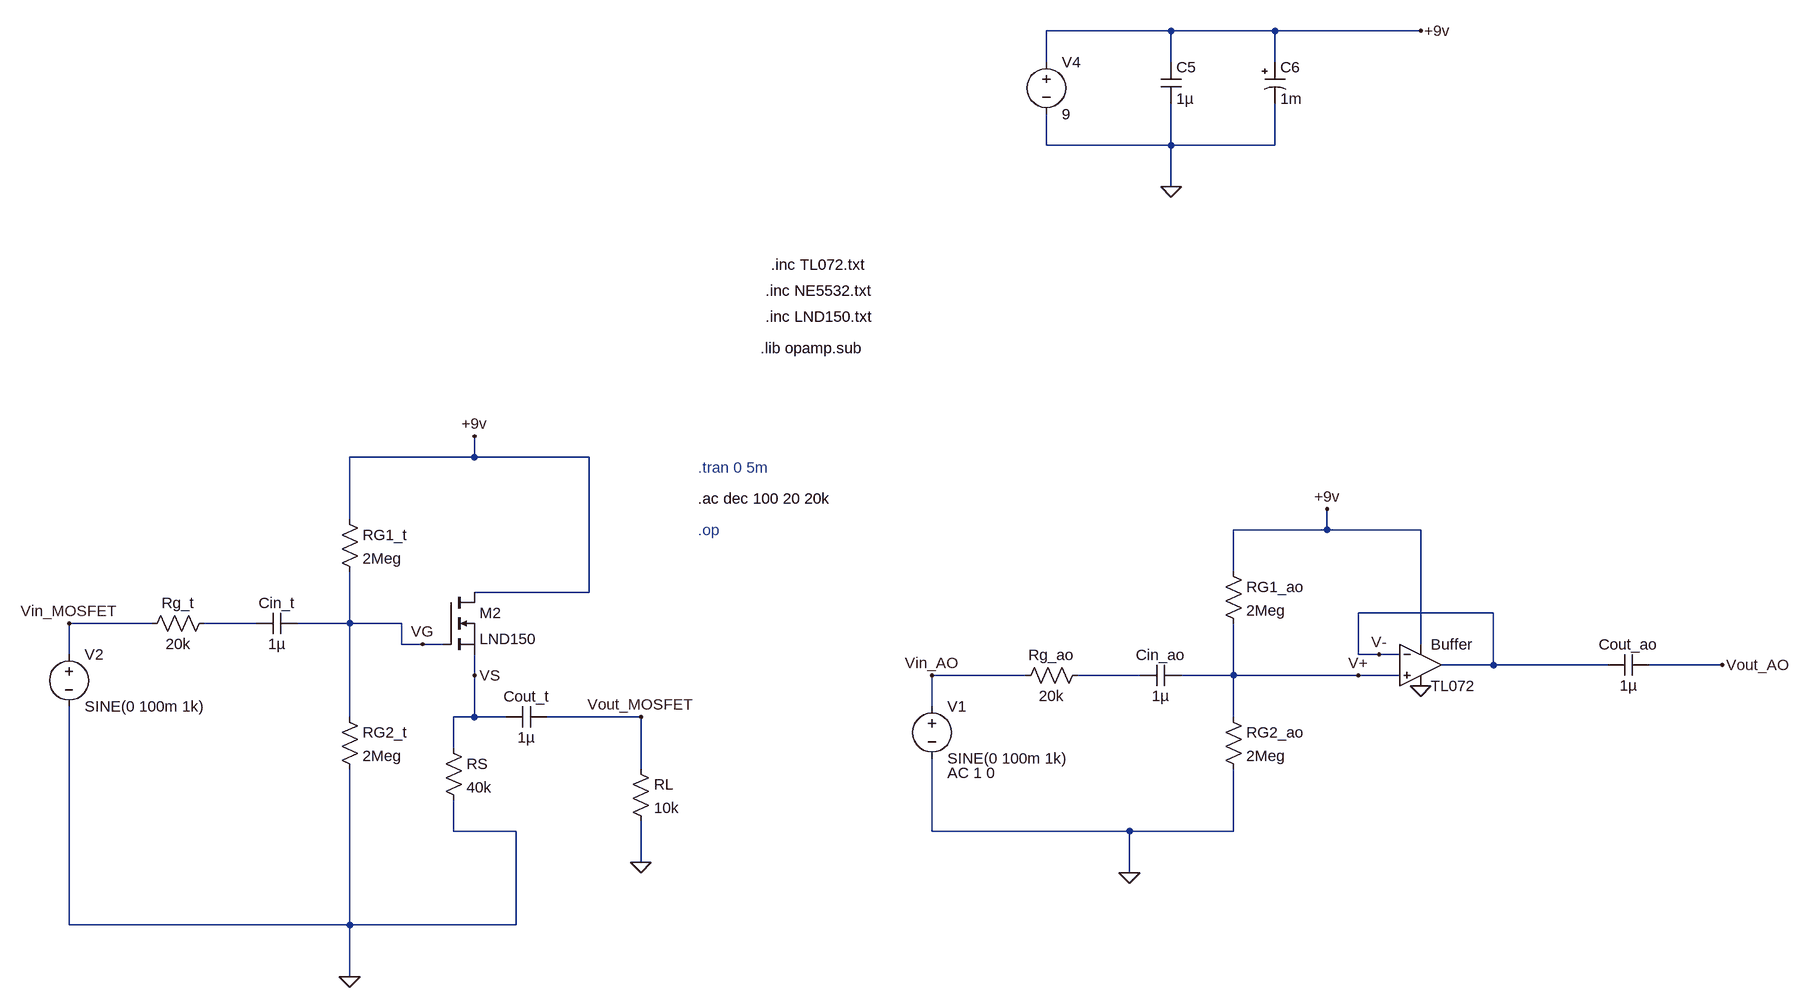
[diagram p0: schematic input_buffer.asc]
input_buffer.asc, the LTspice schematic file:
Version 4
SHEET 1 4380 1924
WIRE 2720 -288 2528 -288
WIRE 2880 -288 2720 -288
WIRE 3104 -288 2880 -288
WIRE 2528 -240 2528 -288
WIRE 2720 -240 2720 -288
WIRE 2880 -240 2880 -288
WIRE 2528 -112 2528 -160
WIRE 2720 -112 2720 -176
WIRE 2720 -112 2528 -112
WIRE 2880 -112 2880 -176
WIRE 2880 -112 2720 -112
WIRE 2720 -48 2720 -112
WIRE 1648 368 1648 336
WIRE 1648 368 1456 368
WIRE 1824 368 1648 368
WIRE 1456 464 1456 368
WIRE 2960 480 2960 448
WIRE 2960 480 2816 480
WIRE 3104 480 2960 480
WIRE 2816 544 2816 480
WIRE 1824 576 1824 368
WIRE 1824 576 1648 576
WIRE 3216 608 3008 608
WIRE 1152 624 1024 624
WIRE 1312 624 1232 624
WIRE 1456 624 1456 544
WIRE 1456 624 1376 624
WIRE 1536 624 1456 624
WIRE 1536 656 1536 624
WIRE 1568 656 1536 656
WIRE 1600 656 1568 656
WIRE 3104 656 3104 480
WIRE 1024 672 1024 624
WIRE 3008 672 3008 608
WIRE 3040 672 3008 672
WIRE 3072 672 3040 672
WIRE 3216 688 3216 608
WIRE 3216 688 3136 688
WIRE 3392 688 3216 688
WIRE 3568 688 3456 688
WIRE 1648 704 1648 672
WIRE 2496 704 2352 704
WIRE 2672 704 2576 704
WIRE 2816 704 2816 624
WIRE 2816 704 2736 704
WIRE 3008 704 2816 704
WIRE 3072 704 3008 704
WIRE 2352 752 2352 704
WIRE 1456 768 1456 624
WIRE 1648 768 1648 704
WIRE 1648 768 1616 768
WIRE 1696 768 1648 768
WIRE 1904 768 1760 768
WIRE 2816 768 2816 704
WIRE 1616 816 1616 768
WIRE 1904 848 1904 768
WIRE 1616 944 1616 896
WIRE 1712 944 1616 944
WIRE 2352 944 2352 832
WIRE 2656 944 2352 944
WIRE 2816 944 2816 848
WIRE 2816 944 2656 944
WIRE 1904 992 1904 928
WIRE 2656 1008 2656 944
WIRE 1024 1088 1024 752
WIRE 1456 1088 1456 848
WIRE 1456 1088 1024 1088
WIRE 1712 1088 1712 944
WIRE 1712 1088 1456 1088
WIRE 1456 1168 1456 1088
FLAG 2720 -48 0
FLAG 3104 -288 +9v
FLAG 2352 704 Vin_AO
FLAG 3568 688 Vout_AO
FLAG 3104 720 0
FLAG 2656 1008 0
FLAG 2960 448 +9v
FLAG 1456 1168 0
FLAG 1024 624 Vin_MOSFET
FLAG 1904 768 Vout_MOSFET
FLAG 1568 656 VG
FLAG 1648 704 VS
FLAG 1648 336 +9v
FLAG 3008 704 V+
FLAG 3040 672 V-
FLAG 1904 992 0
SYMBOL voltage 2528 -256 R0
SYMATTR InstName V4
SYMATTR Value 9
SYMBOL Cap 2704 -240 R0
SYMATTR InstName C5
SYMATTR Value 1µ
SYMBOL polcap 2864 -240 R0
WINDOW 3 24 56 Left 2
SYMATTR Value 1m
SYMATTR InstName C6
SYMATTR Description Capacitor
SYMATTR Type cap
SYMATTR SpiceLine Rser=21m Lser=0 mfg="Chemi-Con" pn="LXF25VB222M12X40LL" type="Al electrolytic"
SYMBOL voltage 2352 736 R0
WINDOW 123 24 118 Left 2
WINDOW 39 0 0 Left 0
SYMATTR Value2 AC 1 0
SYMATTR InstName V1
SYMATTR Value SINE(0 100m 1k)
SYMBOL Cap 2736 688 R90
WINDOW 0 0 32 VBottom 2
WINDOW 3 32 32 VTop 2
SYMATTR InstName Cin_ao
SYMATTR Value 1µ
SYMBOL Res 2800 752 R0
SYMATTR InstName RG2_ao
SYMATTR Value 2Meg
SYMBOL Cap 3456 672 R90
WINDOW 0 0 32 VBottom 2
WINDOW 3 32 32 VTop 2
SYMATTR InstName Cout_ao
SYMATTR Value 1µ
SYMBOL Res 2800 528 R0
SYMATTR InstName RG1_ao
SYMATTR Value 2Meg
SYMBOL Res 2592 688 R90
WINDOW 0 0 56 VBottom 2
WINDOW 3 32 56 VTop 2
SYMATTR InstName Rg_ao
SYMATTR Value 20k
SYMBOL opamp2 3104 624 R0
SYMATTR InstName Buffer
SYMATTR Value TL072
SYMBOL voltage 1024 656 R0
SYMATTR InstName V2
SYMATTR Value SINE(0 100m 1k)
SYMATTR Value2 AC 1 0
SYMBOL Cap 1376 608 R90
WINDOW 0 0 32 VBottom 2
WINDOW 3 32 32 VTop 2
SYMATTR InstName Cin_t
SYMATTR Value 1µ
SYMBOL Cap 1760 752 R90
WINDOW 0 0 32 VBottom 2
WINDOW 3 32 32 VTop 2
SYMATTR InstName Cout_t
SYMATTR Value 1µ
SYMBOL Res 1600 800 R0
SYMATTR InstName RS
SYMATTR Value 40k
SYMBOL nmos 1600 576 R0
SYMATTR InstName M2
SYMATTR Value LND150
SYMBOL Res 1248 608 R90
WINDOW 0 0 56 VBottom 2
WINDOW 3 32 56 VTop 2
SYMATTR InstName Rg_t
SYMATTR Value 20k
SYMBOL Res 1440 448 R0
SYMATTR InstName RG1_t
SYMATTR Value 2Meg
SYMBOL Res 1440 752 R0
SYMATTR InstName RG2_t
SYMATTR Value 2Meg
SYMBOL Res 1888 832 R0
SYMATTR InstName RL
SYMATTR Value 10k
TEXT 1992 384 Left 2 ;.tran 0 5m
TEXT 2088 200 Left 2 !.lib opamp.sub
TEXT 1992 480 Left 2 ;.op
TEXT 2096 152 Left 2 !.inc LND150.txt
TEXT 2096 112 Left 2 !.inc NE5532.txt
TEXT 1992 432 Left 2 !.ac dec 100 20 20k
TEXT 2104 72 Left 2 !.inc TL072.txt

The netlist it stands for:
* input_buffer.asc
V4 +9v 0 9
C5 +9v 0 1µ
C6 +9v 0 1m Rser=21m Lser=0 mfg="Chemi-Con" pn="LXF25VB222M12X40LL" type="Al electrolytic"
V1 Vin_AO 0 SINE(0 100m 1k) AC 1 0
Cin_ao V+ N002 1µ
RG2_ao V+ 0 2Meg
Cout_ao Vout_AO V- 1µ
RG1_ao +9v V+ 2Meg
Rg_ao N002 Vin_AO 20k
XBuffer V+ V- +9v 0 V- TL072  ; pins In+ In- V+ V- OUT
V2 Vin_MOSFET 0 SINE(0 100m 1k) AC 1 0
Cin_t VG N001 1µ
Cout_t Vout_MOSFET VS 1µ
RS VS 0 40k
M2 +9v VG VS VS LND150
Rg_t N001 Vin_MOSFET 20k
RG1_t +9v VG 2Meg
RG2_t VG 0 2Meg
RL Vout_MOSFET 0 10k
.model NMOS NMOS
.model PMOS PMOS
.lib standard.mos
* .tran 0 5m
.lib opamp.sub
* .op
.inc LND150.txt
.inc NE5532.txt
.ac dec 100 20 20k
.inc TL072.txt
.backanno
.end